# EasyEDA schematic SCH_Octacon_Pots_Leds.json
TITLE: Pots and Leds; REV: 1.0; Date: 2025-04-18; Sheet: 1/1; Drawn By: Stefan Sauer; Company: Ensonic
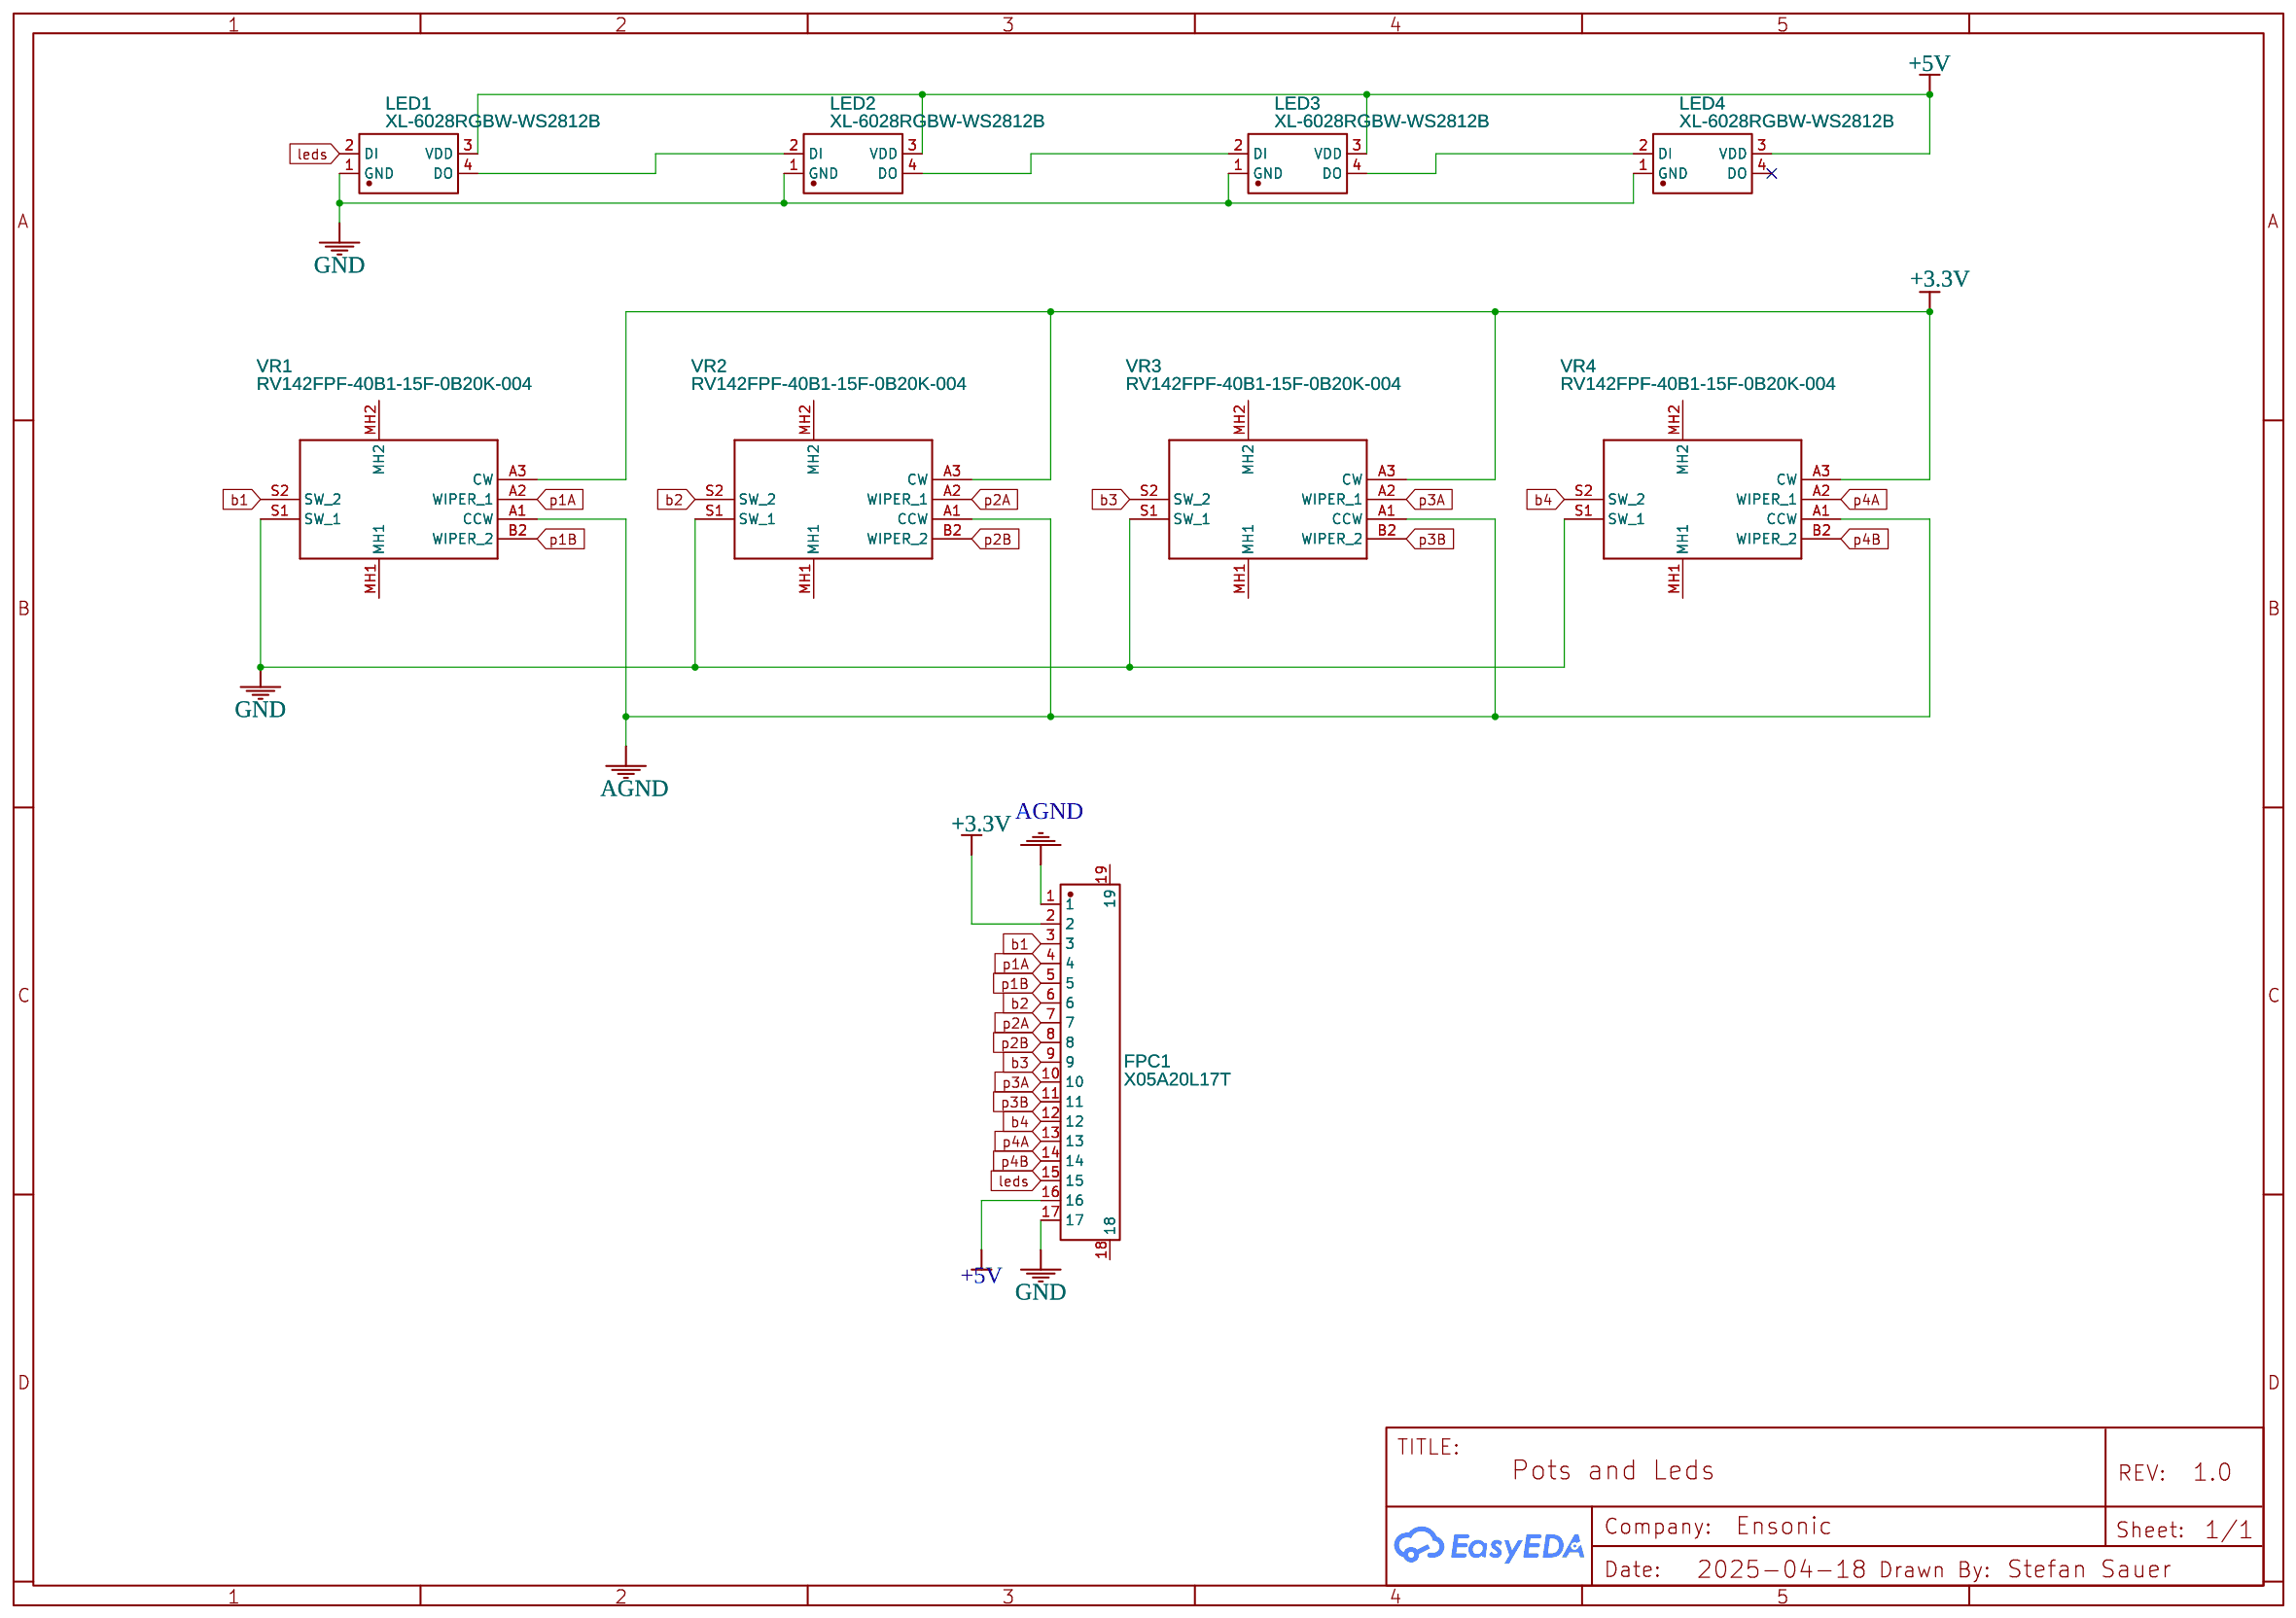
[diagram p0: schematic sheet]

## Parts
FPC1  X05A20L17T  [FFC-SMD_X05A20L17T]
LED1  XL-6028RGBW-WS2812B  [LED-SMD_4P-L3.2-W2.8-XL-6028RGBW-WS2812B]
LED2  XL-6028RGBW-WS2812B  [LED-SMD_4P-L3.2-W2.8-XL-6028RGBW-WS2812B]
LED3  XL-6028RGBW-WS2812B  [LED-SMD_4P-L3.2-W2.8-XL-6028RGBW-WS2812B]
LED4  XL-6028RGBW-WS2812B  [LED-SMD_4P-L3.2-W2.8-XL-6028RGBW-WS2812B]
VR1  RV142FPF-40B1-15F-0B20K-004  [RV142FPF40B115F0B20K004]
VR2  RV142FPF-40B1-15F-0B20K-004  [RV142FPF40B115F0B20K004]
VR3  RV142FPF-40B1-15F-0B20K-004  [RV142FPF40B115F0B20K004]
VR4  RV142FPF-40B1-15F-0B20K-004  [RV142FPF40B115F0B20K004]

## Library data of the parts
FPC1 = X05A20L17T: Contributor: LCSC; Supplier: LCSC; Supplier Part: C388672; Manufacturer: XKB Connection(中国星坤); JLCPCB Part Class: Extended Part
LED1-LED4 = XL-6028RGBW-WS2812B: Supplier: LCSC; Supplier Part: C42163197; Manufacturer: XINGLIGHT(成兴光); Contributor: lcsc; JLCPCB Part Class: Extended Part
VR1-VR4 = RV142FPF-40B1-15F-0B20K-004: Contributor: DBazinet

## Nets
+3.3V: FPC1.2 VR1.A3(CW) VR2.A3(CW) VR3.A3(CW) VR4.A3(CW)
+5V: FPC1.16 LED1.3(VDD) LED2.3(VDD) LED3.3(VDD) LED4.3(VDD)
AGND: FPC1.1 VR1.A1(CCW) VR2.A1(CCW) VR3.A1(CCW) VR4.A1(CCW)
GND: FPC1.17 LED1.1(GND) LED2.1(GND) LED3.1(GND) LED4.1(GND) VR1.S1(SW_1) VR2.S1(SW_1) VR3.S1(SW_1) VR4.S1(SW_1)
b1: FPC1.3 VR1.S2(SW_2)
b2: FPC1.6 VR2.S2(SW_2)
b3: FPC1.9 VR3.S2(SW_2)
b4: FPC1.12 VR4.S2(SW_2)
leds: FPC1.15 LED1.2(DI)
p1A: FPC1.4 VR1.A2(WIPER_1)
p1B: FPC1.5 VR1.B2(WIPER_2)
p2A: FPC1.7 VR2.A2(WIPER_1)
p2B: FPC1.8 VR2.B2(WIPER_2)
p3A: FPC1.10 VR3.A2(WIPER_1)
p3B: FPC1.11 VR3.B2(WIPER_2)
p4A: FPC1.13 VR4.A2(WIPER_1)
p4B: FPC1.14 VR4.B2(WIPER_2)
Net-(LED1-4): LED1.4(DO) LED2.2(DI)
Net-(LED2-4): LED2.4(DO) LED3.2(DI)
Net-(LED3-4): LED3.4(DO) LED4.2(DI)

Not connected (* = marked no-connect by the designer): FPC1 18 19; LED4 4(DO)*; VR1 MH1 MH2; VR2 MH1 MH2; VR3 MH1 MH2; VR4 MH1 MH2
